# EAGLE design photoresistor (EAGLE 7.7.0)
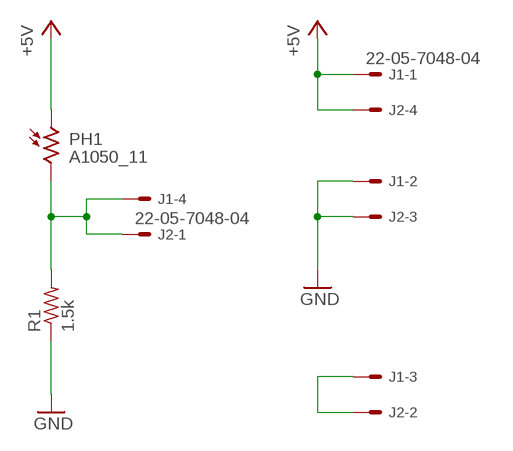
[diagram p0: schematic, sheet 1]

## Parts
J1  22-05-7048-04  [7395-04]
J2  22-05-7048-04  [7395-04]
PH1  A1050_11  [T0-46-A10XX]
R1  1.5k  R-US_M0805  [M0805]

## Nets
+5V: J1.1 J2.4 PH1.1
GND: J1.2 J2.3 R1.1
N$1: J1.3 J2.2
N$3: J1.4 J2.1 PH1.2 R1.2

## Library data of the parts
J1 J2 = con-molex:22-?-04: CONNECTOR wire to board 2.54 mm (.1 inch) pitch header; OC_FARNELL: unknown; OC_NEWARK: unknown
PH1 = photo-elements:A10: Sensor Robust Light Sensing Applications Outdoor Light Sensing Application Source: http://optoelectronics.perkinelmer.com/content/Datasheets/DTS_PhotocellsA1050.pdf
R1 = resistor:R-US_: RESISTOR, American symbol

## Board
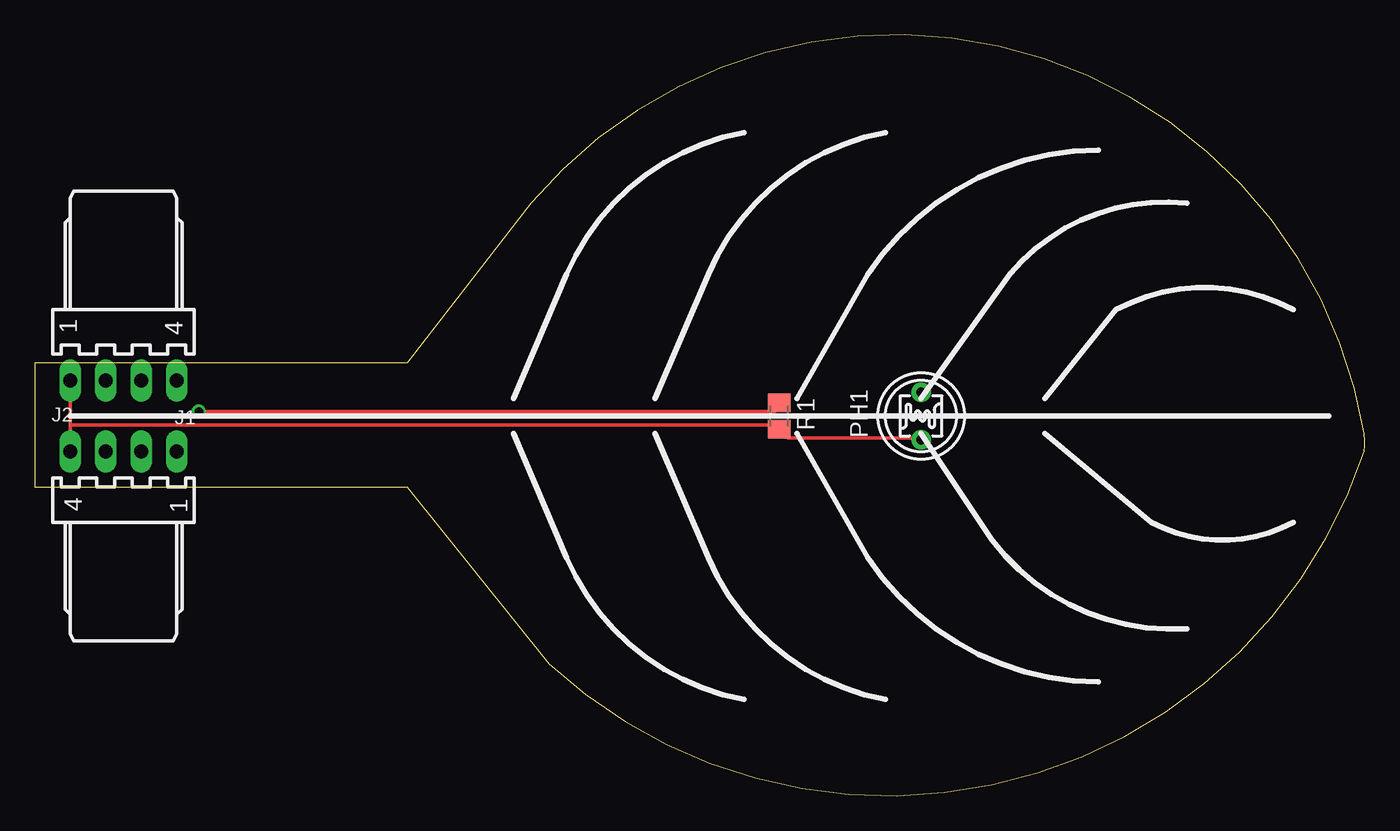
[diagram p1: board, top side]
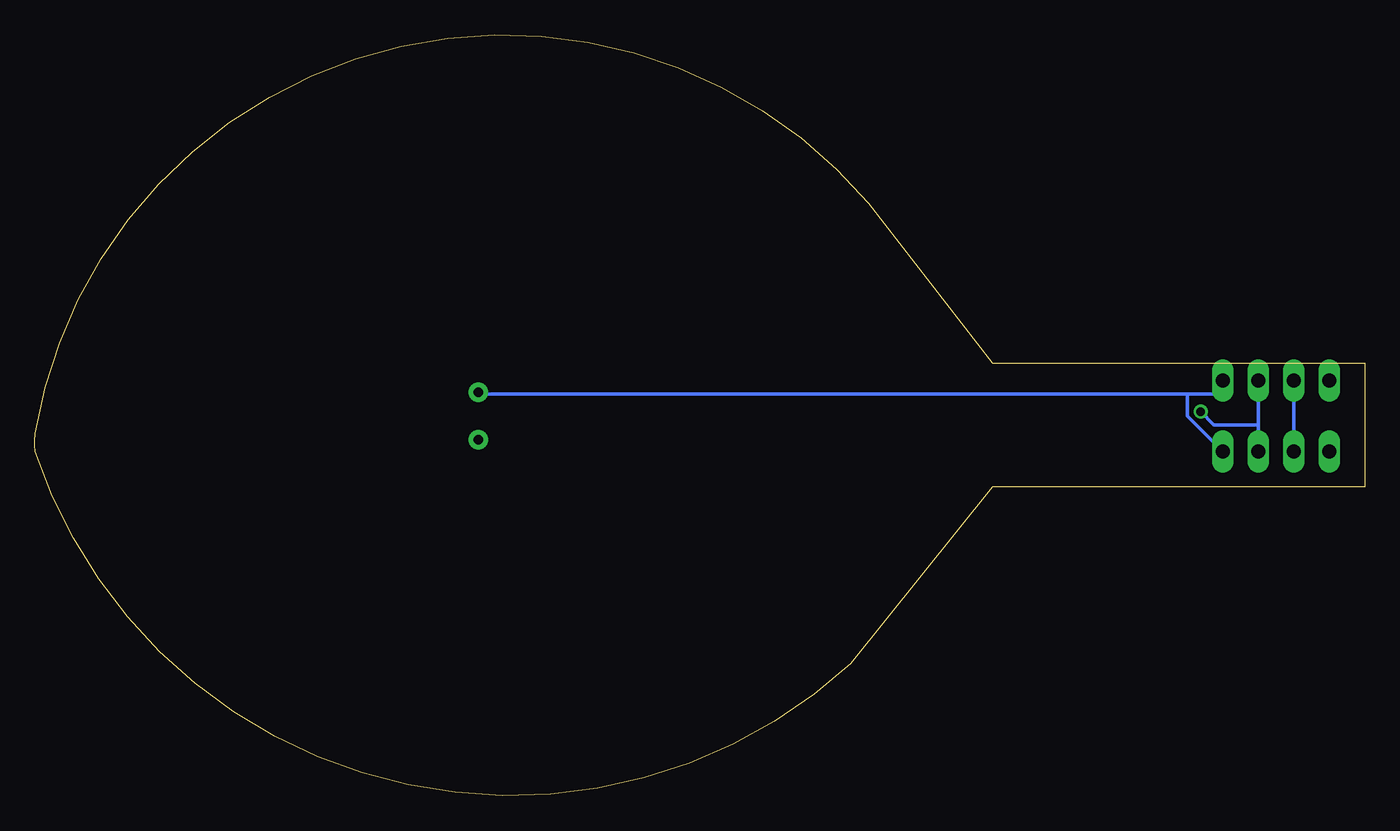
[diagram p2: board, bottom side, seen from below]

Size 95.28 x 54.53 mm. Coordinates in mm from the lower left corner, seen from the top.
Outline: 0,22.13 26.67,22.13 36.83,9.43 arc114 95.25,24.67 95.28,25.11 95.28,25.41 95.25,25.94 arc131 35.56,42.45 26.67,31.01 0,31.01 0,22.13
Copper layers (1*16): Top 0.035mm / dielectric 1.5mm / Bottom 0.035mm
Design rules "default": minimum track width 10mil, minimum drill 24mil, track to track 8mil, track to pad 8mil, pad to pad 8mil, via to via 8mil, smd to smd 8mil, copper to edge 40mil, drill to drill 8mil, minimum pad ring 10mil, minimum via ring 8mil, stop-mask expansion 4mil, vias tented up to drill 0mil, thermal gap 10mil

### Footprints (pad centres in the part's own frame; a part is rotated, then mirrored left to right if it is on the bottom)
7395-04 = drill 1.016 long: 1 3.81,0; 2 1.27,0; 3 -1.27,0; 4 -3.81,0
T0-46-A10XX = drill 0.7 pad 1.4: 1 -1.7,0; 2 1.7,0
M0805 = smd 1.3 x 1.6: 1 -0.95,0; 2 0.95,0

### Placement (x,y rotation side)
J1  6.35,24.67 0 top
J2  6.35,29.75 180 top
PH1  63.5,27.21 270 top
R1  53.34,27.21 270 top

### Tracks (layer width: path | path; a pad name or v marks a point on that pad's centre or on a via)
+5V
  Bottom 0.254: 12.7,28.8 10.16,28.8 J2.4 | 12.7,28.8 63.5,28.8 PH1.1 | J1.1 12.7,27.21 12.7,28.8
GND  (via drill 0.61)
  Top 0.254: v11.75,27.53 53.02,27.53 53.34,27.84 R1.1
  Bottom 0.254: v11.75,27.53 10.79,26.57 7.62,26.57 | J2.3 7.62,26.57 | 7.62,26.57 J1.2
N$1
  Bottom 0.254: J2.2 J1.3
N$3
  Top 0.254: J2.1 2.54,26.57 | 2.54,26.57 J1.4 | PH1.2 63.5,25.62 53.98,25.62 R1.2 53.34,26.57 2.54,26.57